# EAGLE design RPiEvmLcd (EAGLE 9.6.2)
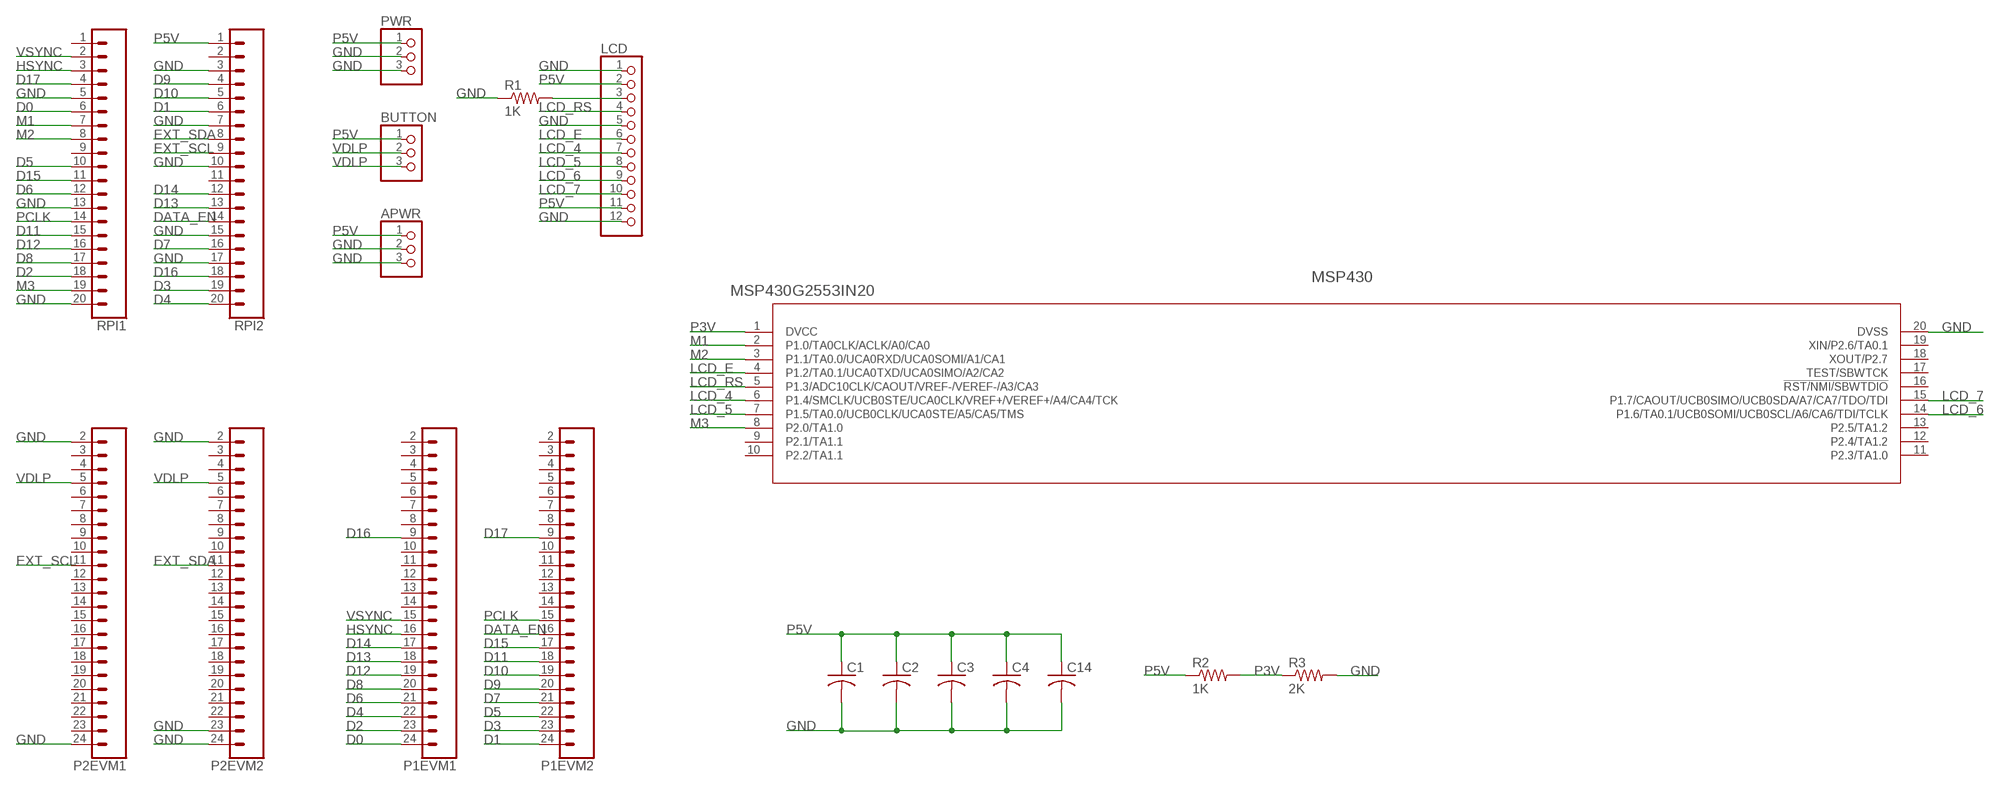
[diagram p0: schematic, sheet 1]

## Parts
APWR  PINHD-1X3  [1X03]
BUTTON  PINHD-1X3  [1X03]
C1  C-US075-042X103  [C075-042X103]
C2  C-US075-042X103  [C075-042X103]
C3  C-US075-042X103  [C075-042X103]
C4  C-US075-042X103  [C075-042X103]
C14  C-US075-042X103  [C075-042X103]
LCD  PINHD-1X12  [1X12]
MSP430  MSP430G2553IN20  [N20_TEX]
P1EVM1  CONN_23  [1X23]
P1EVM2  CONN_23  [1X23]
P2EVM1  CONN_23  [1X23]
P2EVM2  CONN_23  [1X23]
PWR  PINHD-1X3  [1X03]
R1  1K  R-US_0204/5  [0204/5]
R2  1K  R-US_0204/5  [0204/5]
R3  2K  R-US_0204/5  [0204/5]
RPI1  CONN_20  [1X20]
RPI2  CONN_20  [1X20]

## Nets
D0: P1EVM1.24 RPI1.6
D1: P1EVM2.24 RPI2.6
D2: P1EVM1.23 RPI1.18
D3: P1EVM2.23 RPI2.19
D4: P1EVM1.22 RPI2.20
D5: P1EVM2.22 RPI1.10
D6: P1EVM1.21 RPI1.12
D7: P1EVM2.21 RPI2.16
D8: P1EVM1.20 RPI1.17
D9: P1EVM2.20 RPI2.4
D10: P1EVM2.19 RPI2.5
D11: P1EVM2.18 RPI1.15
D12: P1EVM1.19 RPI1.16
D13: P1EVM1.18 RPI2.13
D14: P1EVM1.17 RPI2.12
D15: P1EVM2.17 RPI1.11
D16: P1EVM1.9 RPI2.18
D17: P1EVM2.9 RPI1.4
DATA_EN: P1EVM2.16 RPI2.14
EXT_SCL: P2EVM1.11 RPI2.9
EXT_SDA: P2EVM2.11 RPI2.8
GND: APWR.2 APWR.3 C1.2 C2.2 C3.2 C4.2 C14.2 LCD.1 LCD.5 LCD.12 MSP430.20(DVSS) P2EVM1.2 P2EVM1.24 P2EVM2.2 P2EVM2.23 P2EVM2.24 PWR.2 PWR.3 R1.1 R3.2 RPI1.5 RPI1.13 RPI1.20 RPI2.3 RPI2.7 RPI2.10 RPI2.15 RPI2.17
HSYNC: P1EVM1.16 RPI1.3
LCD_4: LCD.7 MSP430.6(P1.4/SMCLK/UCB0STE/UCA0CLK/VREF+/VEREF+/A4/CA4/TCK)
LCD_5: LCD.8 MSP430.7(P1.5/TA0.0/UCB0CLK/UCA0STE/A5/CA5/TMS)
LCD_6: LCD.9 MSP430.14(P1.6/TA0.1/UCB0SOMI/UCB0SCL/A6/CA6/TDI/TCLK)
LCD_7: LCD.10 MSP430.15(P1.7/CAOUT/UCB0SIMO/UCB0SDA/A7/CA7/TDO/TDI)
LCD_E: LCD.6 MSP430.4(P1.2/TA0.1/UCA0TXD/UCA0SIMO/A2/CA2)
LCD_RS: LCD.4 MSP430.5(P1.3/ADC10CLK/CAOUT/VREF-/VEREF-/A3/CA3)
M1: MSP430.2(P1.0/TA0CLK/ACLK/A0/CA0) RPI1.7
M2: MSP430.3(P1.1/TA0.0/UCA0RXD/UCA0SOMI/A1/CA1) RPI1.8
M3: MSP430.8(P2.0/TA1.0) RPI1.19
N$5: LCD.3 R1.2
P3V: MSP430.1(DVCC) R2.2 R3.1
P5V: APWR.1 BUTTON.1 C1.1 C2.1 C3.1 C4.1 C14.1 LCD.2 LCD.11 PWR.1 R2.1 RPI2.1
PCLK: P1EVM2.15 RPI1.14
VDLP: BUTTON.2 BUTTON.3 P2EVM1.5 P2EVM2.5
VSYNC: P1EVM1.15 RPI1.2
Unconnected: MSP430.9(P2.1/TA1.1) MSP430.10(P2.2/TA1.1) MSP430.11(P2.3/TA1.0) MSP430.12(P2.4/TA1.2) MSP430.13(P2.5/TA1.2) MSP430.16(!RST/NMI/SBWTDIO) MSP430.17(TEST/SBWTCK) MSP430.18(XOUT/P2.7) MSP430.19(XIN/P2.6/TA0.1) P1EVM1.2 P1EVM1.3 P1EVM1.4 P1EVM1.5 P1EVM1.6 P1EVM1.7 P1EVM1.8 P1EVM1.10 P1EVM1.11 P1EVM1.12 P1EVM1.13 P1EVM1.14 P1EVM2.2 P1EVM2.3 P1EVM2.4 P1EVM2.5 P1EVM2.6 P1EVM2.7 P1EVM2.8 P1EVM2.10 P1EVM2.11 P1EVM2.12 P1EVM2.13 P1EVM2.14 P2EVM1.3 P2EVM1.4 P2EVM1.6 P2EVM1.7 P2EVM1.8 P2EVM1.9 P2EVM1.10 P2EVM1.12 P2EVM1.13 P2EVM1.14 P2EVM1.15 P2EVM1.16 P2EVM1.17 P2EVM1.18 P2EVM1.19 P2EVM1.20 P2EVM1.21 P2EVM1.22 P2EVM1.23 P2EVM2.3 P2EVM2.4 P2EVM2.6 P2EVM2.7 P2EVM2.8 P2EVM2.9 P2EVM2.10 P2EVM2.12 P2EVM2.13 P2EVM2.14 P2EVM2.15 P2EVM2.16 P2EVM2.17 P2EVM2.18 P2EVM2.19 P2EVM2.20 P2EVM2.21 P2EVM2.22 RPI1.1 RPI1.9 RPI2.2 RPI2.11

## Library data of the parts
APWR BUTTON PWR = adafruit:PINHD-1X3: PIN HEADER
C1-C4 C14 = adafruit:C-US: CAPACITOR, American symbol
LCD = adafruit:PINHD-1X12: PIN HEADER
MSP430 = msp32pin:MSP430G2553IN20; BUILT_BY: EMA_UL_Team; MANUFACTURER_PART_NUMBER: MSP430G2553IN20; SOURCELIBRARY: TI_2016-12-05; VENDOR: Texas Instruments
P1EVM1 P1EVM2 P2EVM1 P2EVM2 = SparkFun-Connectors:CONN_23: Multi connection point. Often used as Generic Header-pin footprint for 0.1 inch spaced/style header connections On any of the 0.1 inch spaced packages, you can populate with these: Break Away Headers - Straight <https://www.sparkfun.com/products/116> (PRT-00116) Break Away Male Headers - Right Angle <https://www.sparkfun.com/products/553> (PRT-00553) Female Headers <https://www.sparkfun.com/products/115> (PRT-00115) Break Away Headers - Machine Pin <https://www.sparkfun.com/products/117> (PRT-00117) Break Away Female Headers - Swiss Machine Pin <https://www.sparkfun.com/products/743> (PRT-00743) For SCREWTERMINALS and SPRING TERMINALS visit here: Screw Terimnals on SparkFun.com <https://www.sparkfun.com/search/results?term=Screw+Terminals> (5mm/3.5mm/2.54mm spacing) This device is also useful as a general connection point to wire up your design to another part of your project. Our various solder wires solder well into these plated through hole pads. Hook-Up Wire - Assortment (Stranded, 22 AWG) <https://www.sparkfun.com/products/11375> (PRT-11375) Hook-Up Wire - Assortment (Solid Core, 22 AWG) <https://www.sparkfun.com/products/11367> (PRT-11367) View the entire wire category on our website here <https://www.sparkfun.com/categories/141> Special notes: Molex polarized connector foot print use with SKU : PRT-08231 with associated crimp pins and housings. 1MM SMD Version SKU: PRT-10208 NOTES ON THE VARIANTS LOCK and LOCK_LONGPADS... This footprint was designed to help hold the alignment of a through-hole component (i.e. 6-pin header) while soldering it into place. You may notice that each hole has been shifted either up or down by 0.005 of an inch from it's more standard position (which is a perfectly straight line). This slight alteration caused the pins (the squares in the middle) to touch the edges of the holes. Because they are alternating, it causes a "brace" to hold the component in place. 0.005 has proven to be the perfect amount of "off-center" position when using our standard breakaway headers. Although looks a little odd when you look at the bare footprint, once you have a header in there, the alteration is very hard to notice. Also,if you push a header all the way into place, it is covered up entirely on the bottom side.
R1-R3 = rcl:R-US_: RESISTOR, American symbol; SPICEPREFIX: R
RPI1 RPI2 = SparkFun-Connectors:CONN_20: Multi connection point. Often used as Generic Header-pin footprint for 0.1 inch spaced/style header connections On any of the 0.1 inch spaced packages, you can populate with these: Break Away Headers - Straight <https://www.sparkfun.com/products/116> (PRT-00116) Break Away Male Headers - Right Angle <https://www.sparkfun.com/products/553> (PRT-00553) Female Headers <https://www.sparkfun.com/products/115> (PRT-00115) Break Away Headers - Machine Pin <https://www.sparkfun.com/products/117> (PRT-00117) Break Away Female Headers - Swiss Machine Pin <https://www.sparkfun.com/products/743> (PRT-00743) For SCREWTERMINALS and SPRING TERMINALS visit here: Screw Terimnals on SparkFun.com <https://www.sparkfun.com/search/results?term=Screw+Terminals> (5mm/3.5mm/2.54mm spacing) This device is also useful as a general connection point to wire up your design to another part of your project. Our various solder wires solder well into these plated through hole pads. Hook-Up Wire - Assortment (Stranded, 22 AWG) <https://www.sparkfun.com/products/11375> (PRT-11375) Hook-Up Wire - Assortment (Solid Core, 22 AWG) <https://www.sparkfun.com/products/11367> (PRT-11367) View the entire wire category on our website here <https://www.sparkfun.com/categories/141> Special notes: Molex polarized connector foot print use with SKU : PRT-08231 with associated crimp pins and housings. 1MM SMD Version SKU: PRT-10208 NOTES ON THE VARIANTS LOCK and LOCK_LONGPADS... This footprint was designed to help hold the alignment of a through-hole component (i.e. 6-pin header) while soldering it into place. You may notice that each hole has been shifted either up or down by 0.005 of an inch from it's more standard position (which is a perfectly straight line). This slight alteration caused the pins (the squares in the middle) to touch the edges of the holes. Because they are alternating, it causes a "brace" to hold the component in place. 0.005 has proven to be the perfect amount of "off-center" position when using our standard breakaway headers. Although looks a little odd when you look at the bare footprint, once you have a header in there, the alteration is very hard to notice. Also,if you push a header all the way into place, it is covered up entirely on the bottom side. Note about LOCK SPECIAL package: This is just like the LOCK variant in that the holes are staggared by 5 mil, but except for the last two holes. They are not altered from the "standard" footprint layout. This is used for a special purpose on the layout of our Graphic LCD Backpack. Make sure you want to use this device before selecting it for you project!

## Board
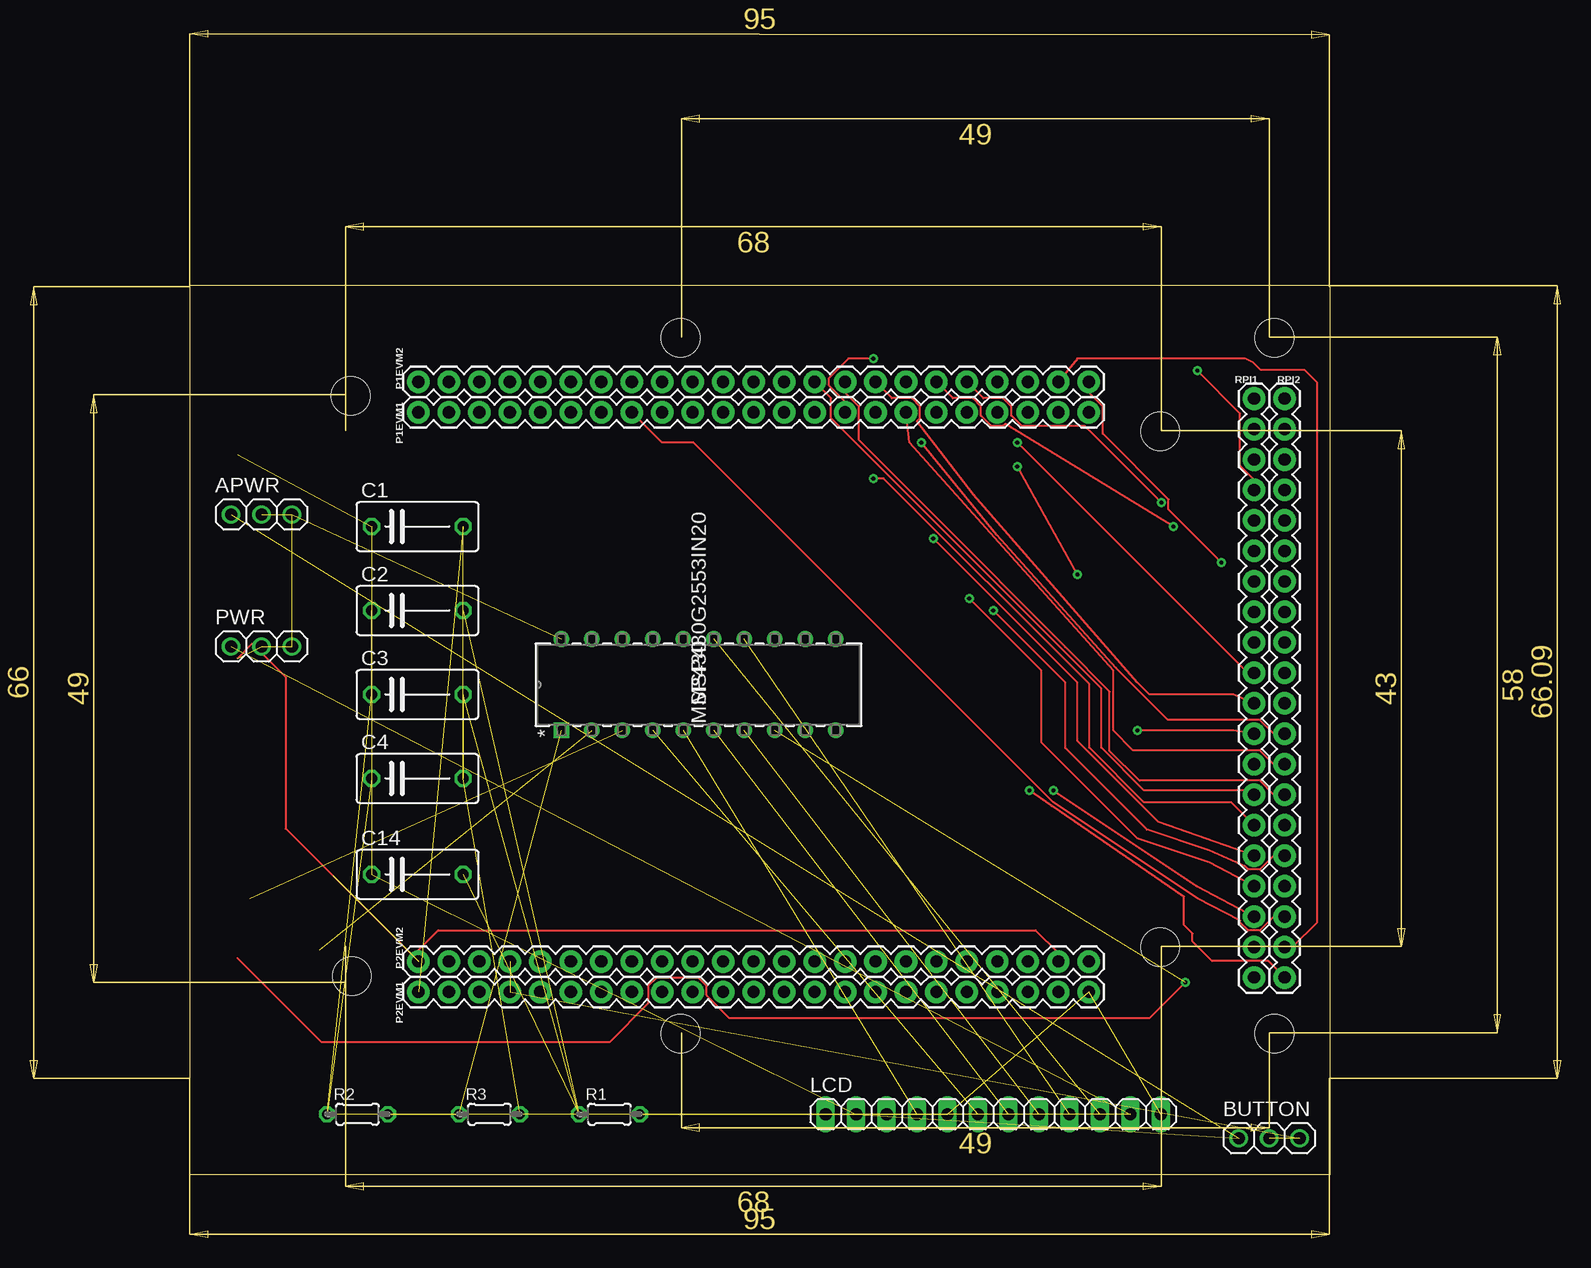
[diagram p1: board, top side]
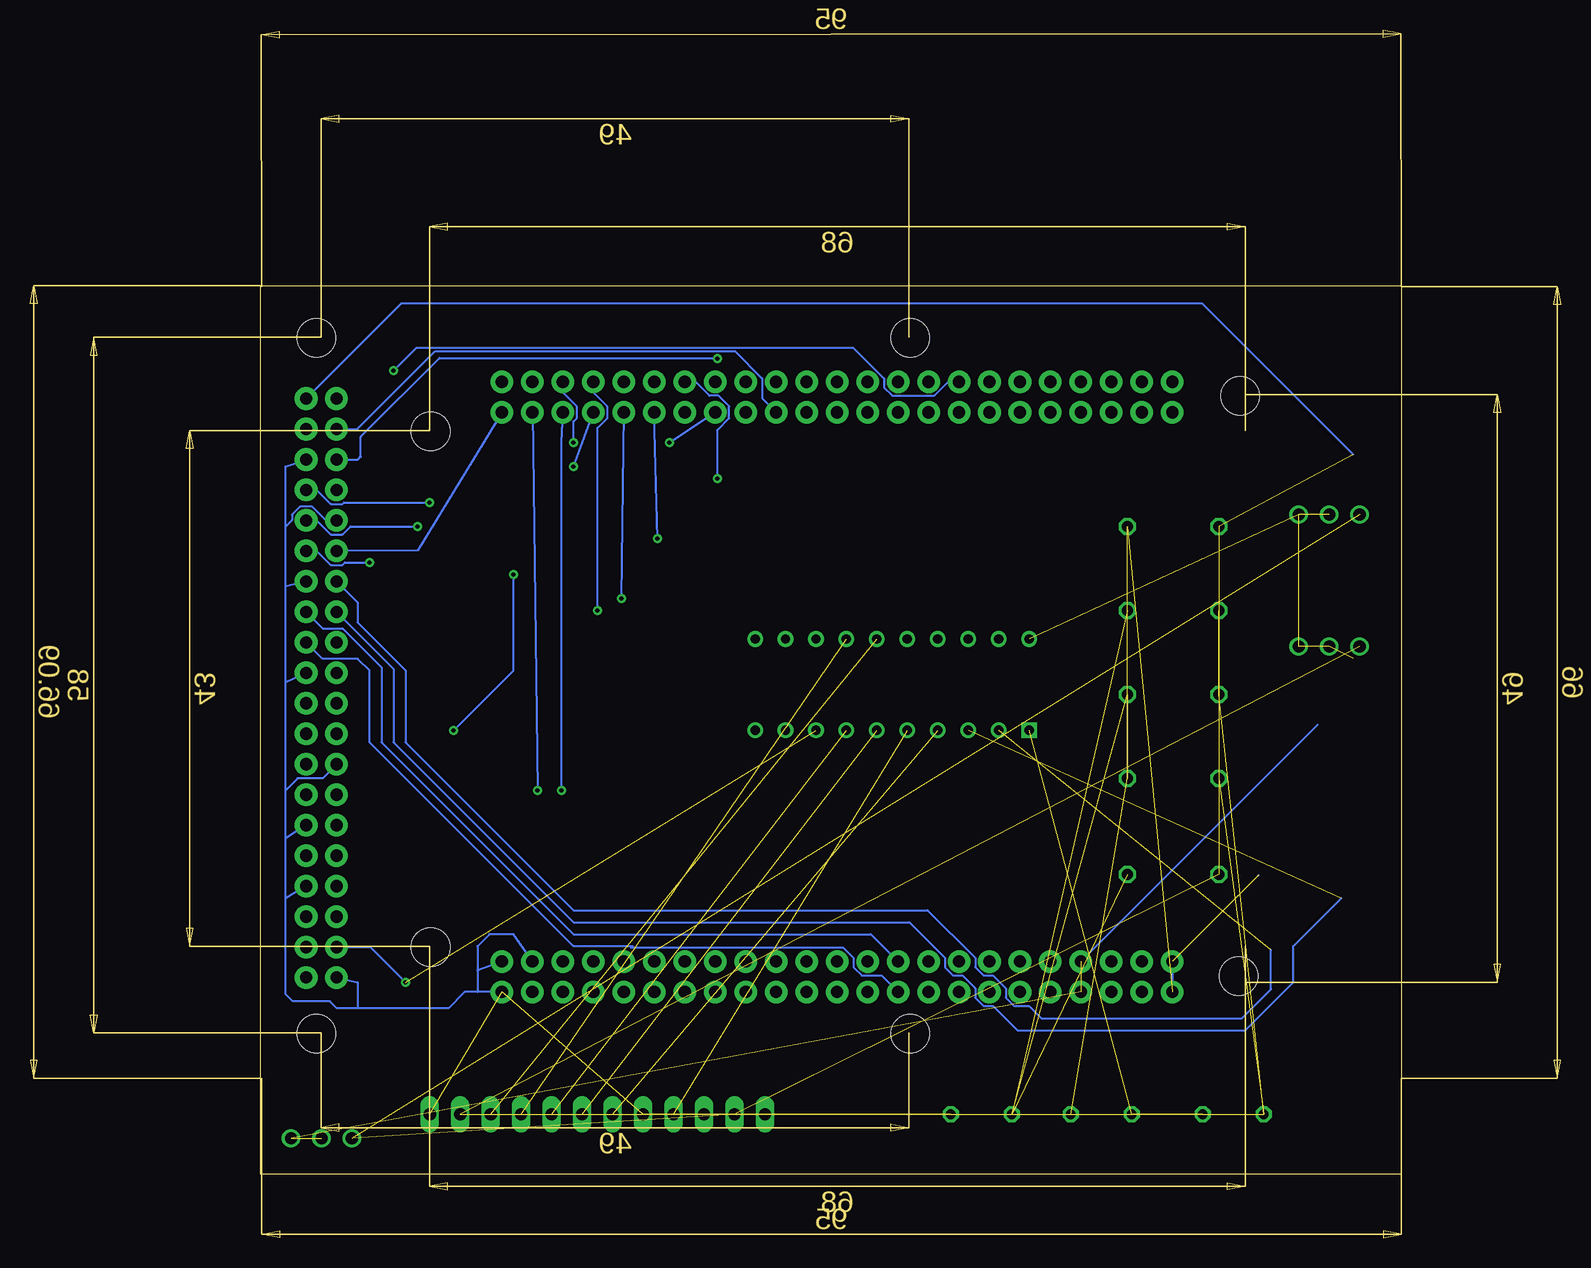
[diagram p2: board, bottom side, seen from below]

Size 95.09 x 74.09 mm. Coordinates in mm from the lower left corner, seen from the top.
Outline: 0,0 95.09,0 95.09,74.09 0,74.09 0,0
Copper layers (1*16): Top 0.035mm / dielectric 1.5mm / Bottom 0.035mm
Design rules "default": minimum track width 6mil, minimum drill 0.35mm, track to track 6mil, track to pad 6mil, pad to pad 6mil, via to via 6mil, smd to smd 6mil, copper to edge 40mil, drill to drill 6mil, minimum pad ring 10mil, minimum via ring 8mil, stop-mask expansion 4mil, vias tented up to drill 0mil, thermal gap 10mil

### Footprints (pad centres in the part's own frame; a part is rotated, then mirrored left to right if it is on the bottom)
1X03 = drill 1.016: 1 -2.54,0; 2 0,0; 3 2.54,0
C075-042X103 = drill 0.914 octagon: 1 -3.81,0; 2 3.81,0
1X12 = drill 1.016 long: 1 -13.97,0; 2 -11.43,0; 3 -8.89,0; 4 -6.35,0; 5 -3.81,0; 6 -1.27,0; 7 1.27,0; 8 3.81,0; 9 6.35,0; 10 8.89,0; 11 11.43,0; 12 13.97,0
N20_TEX = drill 0.787 pad 1.295 square: 1 0,0 | drill 0.787 pad 1.295: 2 0,-2.54; 3 0,-5.08; 4 0,-7.62; 5 0,-10.16; 6 0,-12.7; 7 0,-15.24; 8 0,-17.78; 9 0,-20.32; 10 0,-22.86; 11 7.62,-22.86; 12 7.62,-20.32; 13 7.62,-17.78; 14 7.62,-15.24; 15 7.62,-12.7; 16 7.62,-10.16; 17 7.62,-7.62; 18 7.62,-5.08; 19 7.62,-2.54; 20 7.62,0
1X23 = drill 1.016 pad 1.88: 2 -26.67,0; 3 -24.13,0; 4 -21.59,0; 5 -19.05,0; 6 -16.51,0; 7 -13.97,0; 8 -11.43,0; 9 -8.89,0; 10 -6.35,0; 11 -3.81,0; 12 -1.27,0; 13 1.27,0; 14 3.81,0; 15 6.35,0; 16 8.89,0; 17 11.43,0; 18 13.97,0; 19 16.51,0; 20 19.05,0; 21 21.59,0; 22 24.13,0; 23 26.67,0; 24 29.21,0
0204/5 = drill 0.813 octagon: 1 -2.54,0; 2 2.54,0
1X20 = drill 1.016 pad 1.88: 1 0,0; 2 2.54,0; 3 5.08,0; 4 7.62,0; 5 10.16,0; 6 12.7,0; 7 15.24,0; 8 17.78,0; 9 20.32,0; 10 22.86,0; 11 25.4,0; 12 27.94,0; 13 30.48,0; 14 33.02,0; 15 35.56,0; 16 38.1,0; 17 40.64,0; 18 43.18,0; 19 45.72,0; 20 48.26,0
3_2_HOLE = hole 3.2: -1.57,1.73

### Placement (x,y rotation side)
APWR  6,55 0 top
BUTTON  90,3 0 top
C1  19,54 0 top
C2  19,47 0 top
C3  19,40 0 top
C4  19,33 0 top
C14  19,25 0 top
LCD  67,5 0 top
MSP430  31,37 90 top
P1EVM1  45.75,63.52 0 top
P1EVM2  45.75,66.06 0 top
P2EVM1  45.75,15.2 0 top
P2EVM2  45.75,17.74 0 top
PWR  6,44 0 top
R1  35,5 0 top
R2  14,5 0 top
R3  25,5 0 top
RPI1  88.74,64.66 270 top
RPI2  91.28,64.66 270 top
U$1  [3_2_HOLE]  92,10 0 top
U$2  [3_2_HOLE]  92,68 0 top
U$3  [3_2_HOLE]  15,63.15 0 top
U$4  [3_2_HOLE]  15.11,14.8 0 top
U$5  [3_2_HOLE]  82.47,60.22 0 top
U$6  [3_2_HOLE]  82.47,17.22 0 top
U$7  [3_2_HOLE]  42.5,68 0 top
U$8  [3_2_HOLE]  42.5,10 0 top

### Tracks (layer width: path | path; a pad name or v marks a point on that pad's centre or on a via)
D0
  Bottom 0.152: P1EVM1.24 82,52 RPI1.6
D1  (via drill 0.35)
  Top 0.152: P1EVM2.24 74.96,65.17 76.13,64 76.13,61.73 81.61,56.25 81.61,55.39 v86,51
  Bottom 0.152: RPI2.6 90.39,51.96 89.22,50.79 88.26,50.79 88.05,51 v86,51
D2  (via drill 0.35)
  Top 0.152: v72,32 84,24 RPI1.18
  Bottom 0.152: P1EVM1.23 v72,32
D3
  Top 0.152: RPI2.19 91.94,18.94 94,21 94,66 92.96,67.04 89.31,67.04 88.68,67.68 88,68 74,68 P1EVM2.23
D4  (via drill 0.35)
  Top 0.152: RPI2.20 89.91,17.77 85.23,17.77 83.6,19.4 83.6,20.06 82.89,20.77 82.89,23.14 71.9,30.7 71.87,30.7 71.82,30.75 v70,32
  Bottom 0.152: P1EVM1.22 70,61 v70,32
D5  (via drill 0.35)
  Top 0.152: RPI1.10 88.54,42 88,42 v69,61
  Bottom 0.152: v69,61 69,62.75 68.71,63.04 68.71,64 69.88,65.17 P1EVM2.22
D6  (via drill 0.35)
  Top 0.152: RPI1.12 87,37 v79,37 | v74,50 v69,59
  Bottom 0.152: v69,59 P1EVM1.21 | v79,37 74,42 v74,50
D7  (via drill 0.35)
  Top 0.152: RPI2.16 90.39,26.56 89.22,25.39 88.26,25.39 88,25.65 85,27 79.8,28.73 73,35.53 73,41 v67,47
  Bottom 0.152: v67,47 67,62.21 66.17,63.04 66.17,64 67.34,65.17 P1EVM2.21
D8  (via drill 0.35)
  Top 0.152: RPI1.17 85,26 79,28 71,36 71,42 v65,48
  Bottom 0.152: v65,48 P1EVM1.20
D9  (via drill 0.35)
  Top 0.152: v81,56 74.65,62.35 69.4,62.35 68.51,63.24 68.51,64 67.82,64.69 66.17,64.69 P1EVM2.20
  Bottom 0.152: RPI2.4 90.39,57.04 89.22,55.87 88.26,55.87 88.13,56 v81,56
D10  (via drill 0.35)
  Top 0.152: v82,54 68.02,62.54 67.82,62.35 66.86,62.35 65.97,63.24 65.97,64 65.28,64.69 63.63,64.69 P1EVM2.19
  Bottom 0.152: RPI2.5 90.39,54.5 89.22,53.33 88.26,53.33 87.59,54 v82,54
D11  (via drill 0.35)
  Top 0.152: RPI1.15 86.84,31 79.57,31 75,35.57 75,40.86 57.86,58 v57,58
  Bottom 0.152: P1EVM2.18 58.83,66.06 57.66,64.89 56.9,64.89 56.01,64 56,64 56.01,63.99 56.01,63.04 57,62.05 v57,58
D12  (via drill 0.35)
  Top 0.152: v62,53 74,41 74,36.14 80.76,29.38 RPI1.16
  Bottom 0.152: v62,53 P1EVM1.19
D13
  Top 0.152: RPI2.13 90.39,34.18 89.22,35.35 78.65,35.35 77,37 77,42 60,61 P1EVM1.18
D14  (via drill 0.35)
  Top 0.152: RPI2.12 90.39,36.72 89.22,37.89 81.54,37.89 77.22,42.21 67.32,53.28 v61,61
  Bottom 0.152: v61,61 P1EVM1.17
D15
  Top 0.152: RPI1.11 87,40 80,40 79,41 65.39,56.63 60.66,62.8 60.89,63.04 60.89,64 60.2,64.69 58.55,64.69 P1EVM2.17
D16
  Top 0.152: RPI2.18 90.39,21.48 89.22,20.31 88.26,20.31 87.57,21 87.57,21.16 84,23 72,31 42,61 39.38,61 P1EVM1.9
D17  (via drill 0.35)
  Top 0.152: RPI1.4 88.74,57.93 87.57,59.1 87.57,63.43 v84,67
  Bottom 0.152: P1EVM2.9 37.75,66.06 38.92,64.89 42.42,64.89 43.11,65.58 43.11,66.34 45.68,68.91 82.09,68.91 v84,67
DATA_EN
  Top 0.152: RPI2.14 90.39,31.64 89.22,32.81 79.19,32.81 76.69,35.3 76.69,40.24 73,43.94 62,55 55.81,61.19 55.81,64 54.64,65.17 P1EVM2.16
EXT_SCL
  Bottom 0.152: RPI2.9 89.91,42.97 86.97,42.97 86,42 86,36 69,19 64.09,19 64,18.91 | P2EVM1.11 43.31,16.57 44.96,16.57 45.65,17.26 45.65,18.02 46.54,18.91 64,18.91 | 64.2,18.91 64,18.91
EXT_SDA
  Bottom 0.152: RPI2.8 89.91,45.51 88.26,45.51 85,42.25 85,36 69,20 44.2,20 P2EVM2.11
GND  (16 unrouted)
  Top 0.152: P2EVM2.23 72.42,18.44 70.52,20.34 20.73,20.34 19.08,18.69 P2EVM2.2 8,28.82 8,41.46 5.23,44.23 4,43
  Bottom 0.152: P2EVM1.24 77,15.2 | 77,15.2 78.05,15.2 79.42,13.84 87,13.84 | 87,13.84 88.73,13.84 89.31,14.42 92.42,14.42 93,15 93,23 | 93,23 93,28 | 93,28 93,32 | 93,32 93,41 | 93,41 93,49 | 93,49 93,54 | 93,54 93,59 RPI2.3 | RPI2.7 93,49 | RPI2.10 93,41 | RPI2.15 93,28 | RPI2.17 93,23 | 87,13.84 87,16 RPI1.20 | P2EVM2.23 74,20 76,20 77,19 77,17 | 77,17 77,15.2 | P2EVM2.24 77,17 | 93,54 92.45,54.55 92.45,54.98 91.76,55.67 90.8,55.67 89.63,54.5 RPI1.5 | P2EVM2.2 P2EVM1.2 | 11.91,24.91 11.9,24.92 | RPI1.13 89.92,33 92,33 93,32
HSYNC  (via drill 0.35)
  Top 0.152: P1EVM1.16 54.64,64.41 53.27,65.78 53.27,66.34 54.93,68 v57,68
  Bottom 0.152: v57,68 57.15,68 57.2,68.05 80.17,68.05 86.72,61.49 86.72,59.82 86.96,59.58 RPI1.3 88.71,59.55
LCD_4  (1 unrouted)
LCD_5  (1 unrouted)
LCD_6  (1 unrouted)
LCD_7  (1 unrouted)
LCD_E  (1 unrouted)
LCD_RS  (1 unrouted)
M1  (1 unrouted)
  Bottom 0.152: RPI1.7 87,47.68 87,46 83,42 83,36 69,22 39.47,22 35.49,18.02 35.49,17.26 34.8,16.57 34.04,16.57 32.95,15.48 32.95,14.72 32.26,14.03 31.03,14.03 30,13 13.26,13 10.85,15.41 10.85,18.69
M2  (1 unrouted)
  Bottom 0.152: RPI1.8 84,42.14 84,36 69,21 41,21 38.03,18.03 38.03,17.26 37.34,16.57 36.58,16.57 35.49,15.48 35.49,14.72 34.8,14.03 34.03,14.03 32,12 13,12 9,16 9,19 5,23
M3  (via drill 0.35)  (1 unrouted)
  Top 0.152: v83,16 80,13 45.03,13 43.11,14.92 43.11,15.68 42.42,16.37 38.92,16.37 38.23,15.68 38.23,14.23 35,11 11,11 4,18
  Bottom 0.152: RPI1.19 85.94,18.94 v83,16
N$5  (1 unrouted)
P3V  (2 unrouted)
P5V  (11 unrouted)
  Bottom 0.152: RPI2.1 83.32,72.62 16.62,72.62 4,60
PCLK
  Top 0.152: P1EVM2.15 53.47,64.69 53.47,63.04 76,40.51 76,35.57 79.57,32 88.38,32 RPI1.14
VDLP  (3 unrouted)
  Bottom 0.152: P2EVM2.5 6.98,37.46
VSYNC
  Bottom 0.152: P1EVM1.15 53.27,64.69 53.27,66.34 55.53,68.61 80.52,68.61 87.01,62.12 RPI1.2